# Altium schematic sheet Sheet2.SchDoc
size A4; SheetNumber: 1; SheetTotal: 2
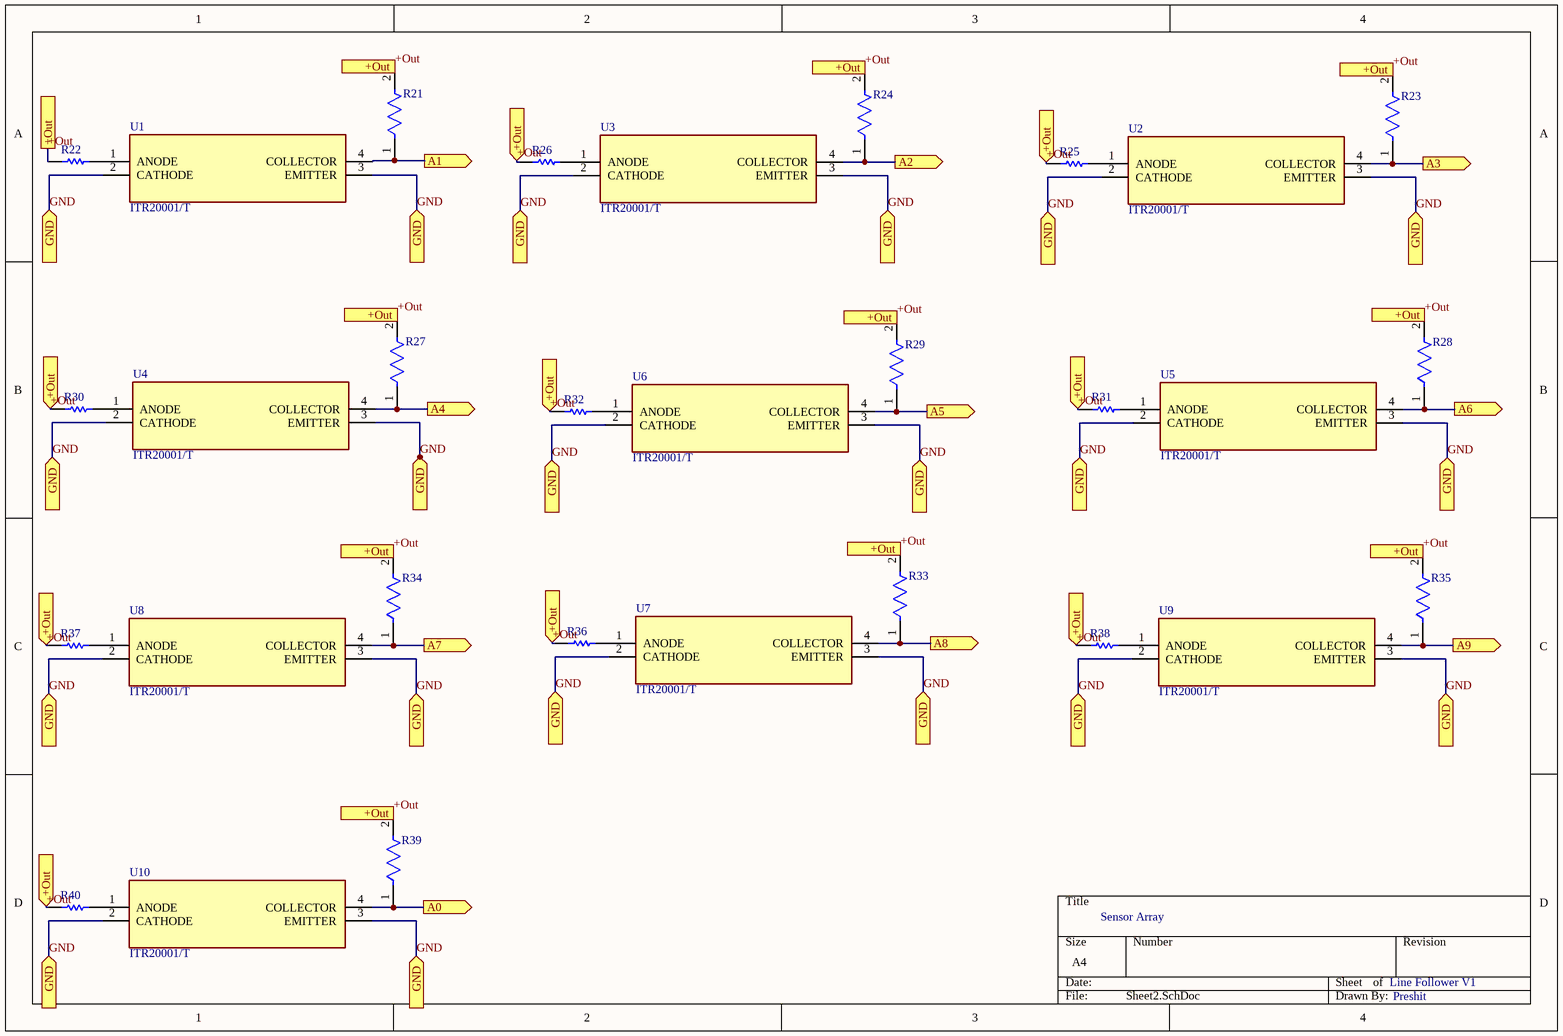
[diagram p0: Sheet2.SchDoc]

## Parts
R21  RN732BTTDK1002B10  [FP-RN732B-MFG]  (value not drawn)
R22  220R 1% 2512(6432)  [RESC2512(6432)_L]  (value not drawn)
R23  RN732BTTDK1002B10  [FP-RN732B-MFG]  (value not drawn)
R24  RN732BTTDK1002B10  [FP-RN732B-MFG]  (value not drawn)
R25  220R 1% 2512(6432)  [RESC2512(6432)_L]  (value not drawn)
R26  220R 1% 2512(6432)  [RESC2512(6432)_L]  (value not drawn)
R27  RN732BTTDK1002B10  [FP-RN732B-MFG]  (value not drawn)
R28  RN732BTTDK1002B10  [FP-RN732B-MFG]  (value not drawn)
R29  RN732BTTDK1002B10  [FP-RN732B-MFG]  (value not drawn)
R30  220R 1% 2512(6432)  [RESC2512(6432)_L]  (value not drawn)
R31  220R 1% 2512(6432)  [RESC2512(6432)_L]  (value not drawn)
R32  220R 1% 2512(6432)  [RESC2512(6432)_L]  (value not drawn)
R33  RN732BTTDK1002B10  [FP-RN732B-MFG]  (value not drawn)
R34  RN732BTTDK1002B10  [FP-RN732B-MFG]  (value not drawn)
R35  RN732BTTDK1002B10  [FP-RN732B-MFG]  (value not drawn)
R36  220R 1% 2512(6432)  [RESC2512(6432)_L]  (value not drawn)
R37  220R 1% 2512(6432)  [RESC2512(6432)_L]  (value not drawn)
R38  220R 1% 2512(6432)  [RESC2512(6432)_L]  (value not drawn)
R39  RN732BTTDK1002B10  [FP-RN732B-MFG]  (value not drawn)
R40  220R 1% 2512(6432)  [RESC2512(6432)_L]  (value not drawn)
U1  ITR20001/T  [RELAY4_ITR20001/T_EVE]
U2  ITR20001/T  [RELAY4_ITR20001/T_EVE]
U3  ITR20001/T  [RELAY4_ITR20001/T_EVE]
U4  ITR20001/T  [RELAY4_ITR20001/T_EVE]
U5  ITR20001/T  [RELAY4_ITR20001/T_EVE]
U6  ITR20001/T  [RELAY4_ITR20001/T_EVE]
U7  ITR20001/T  [RELAY4_ITR20001/T_EVE]
U8  ITR20001/T  [RELAY4_ITR20001/T_EVE]
U9  ITR20001/T  [RELAY4_ITR20001/T_EVE]
U10  ITR20001/T  [RELAY4_ITR20001/T_EVE]

## Ports
+Out (in, see Sheet1[2A], Sheet2[1A], Sheet2[1B], Sheet2[1C], Sheet2[1D], Sheet2[2A], Sheet2[2B], Sheet2[2C], Sheet2[3A], Sheet2[3B], Sheet2[3C], Sheet2[4A], Sheet2[4B]), +Out (in, see Sheet1[2A], Sheet2[1A], Sheet2[1B], Sheet2[1C], Sheet2[1D], Sheet2[2A], Sheet2[2B], Sheet2[2C], Sheet2[3A], Sheet2[3B], Sheet2[3C], Sheet2[4A], Sheet2[4B], Sheet2[4C]), +Out (in, see Sheet1[2A], Sheet2[1A], Sheet2[1B], Sheet2[1C], Sheet2[1D], Sheet2[2A], Sheet2[2B], Sheet2[2C], Sheet2[3A], Sheet2[3B], Sheet2[3C], Sheet2[4A], Sheet2[4C]), +Out (in, see Sheet1[2A], Sheet2[1A], Sheet2[1B], Sheet2[1C], Sheet2[1D], Sheet2[2A], Sheet2[2B], Sheet2[2C], Sheet2[3A], Sheet2[3B], Sheet2[3C], Sheet2[4B], Sheet2[4C]), +Out (in, see Sheet1[2A], Sheet2[1A], Sheet2[1B], Sheet2[1C], Sheet2[1D], Sheet2[2A], Sheet2[2B], Sheet2[3A], Sheet2[3B], Sheet2[3C], Sheet2[4A], Sheet2[4B], Sheet2[4C]), +Out (in, see Sheet1[2A], Sheet2[1A], Sheet2[1B], Sheet2[1C], Sheet2[1D], Sheet2[2A], Sheet2[2C], Sheet2[3A], Sheet2[3B], Sheet2[3C], Sheet2[4A], Sheet2[4B], Sheet2[4C]), +Out (in, see Sheet1[2A], Sheet2[1A], Sheet2[1B], Sheet2[1C], Sheet2[1D], Sheet2[2B], Sheet2[2C], Sheet2[3A], Sheet2[3B], Sheet2[3C], Sheet2[4A], Sheet2[4B], Sheet2[4C]), A0 (out, see Sheet1[4B]), A1 (out, see Sheet1[4B]), A2 (out, see Sheet1[4A]), A3 (out, see Sheet1[4A]), A4 (out, see Sheet1[4A]), A5 (out, see Sheet1[4A]), A6 (out, see Sheet1[4A]), A7 (out, see Sheet1[4A]), A8 (out, see Sheet1[4A]), A9 (out, see Sheet1[4A]), GND (in, see Sheet1[2B], Sheet2[1B], Sheet2[1C], Sheet2[1D], Sheet2[2B], Sheet2[2C], Sheet2[2D], Sheet2[3B], Sheet2[3C], Sheet2[4B]), GND (in, see Sheet1[2B], Sheet2[1B], Sheet2[1C], Sheet2[1D], Sheet2[2B], Sheet2[2C], Sheet2[2D], Sheet2[3B], Sheet2[3C], Sheet2[4B], Sheet2[4C]), GND (in, see Sheet1[2B], Sheet2[1B], Sheet2[1C], Sheet2[1D], Sheet2[2B], Sheet2[2C], Sheet2[3B], Sheet2[3C], Sheet2[4B], Sheet2[4C]), GND (in, see Sheet1[2B], Sheet2[1B], Sheet2[1C], Sheet2[2B], Sheet2[2C], Sheet2[2D], Sheet2[3B], Sheet2[3C], Sheet2[4B], Sheet2[4C]), GND (in, see Sheet1[2B], Sheet2[1B], Sheet2[1D], Sheet2[2B], Sheet2[2C], Sheet2[2D], Sheet2[3B], Sheet2[3C], Sheet2[4B], Sheet2[4C])

## Nets
+Out: R21.2 R22.1 R23.2 R24.2 R25.1 R26.1 R27.2 R28.2 R29.2 R30.1 R31.1 R32.1 R33.2 R34.2 R35.2 R36.1 R37.1 R38.1 R39.2 R40.1 ; port +Out
A0: R39.1 U10.4(COLLECTOR) ; port A0
A1: R21.1 U1.4(COLLECTOR) ; port A1
A2: R24.1 U3.4(COLLECTOR) ; port A2
A3: R23.1 U2.4(COLLECTOR) ; port A3
A4: R27.1 U4.4(COLLECTOR) ; port A4
A5: R29.1 U6.4(COLLECTOR) ; port A5
A6: R28.1 U5.4(COLLECTOR) ; port A6
A7: R34.1 U8.4(COLLECTOR) ; port A7
A8: R33.1 U7.4(COLLECTOR) ; port A8
A9: R35.1 U9.4(COLLECTOR) ; port A9
GND: U1.2(CATHODE) U1.3(EMITTER) U2.2(CATHODE) U2.3(EMITTER) U3.2(CATHODE) U3.3(EMITTER) U4.2(CATHODE) U4.3(EMITTER) U5.2(CATHODE) U5.3(EMITTER) U6.2(CATHODE) U6.3(EMITTER) U7.2(CATHODE) U7.3(EMITTER) U8.2(CATHODE) U8.3(EMITTER) U9.2(CATHODE) U9.3(EMITTER) U10.2(CATHODE) U10.3(EMITTER) ; port GND
NetR22_2: R22.2 U1.1(ANODE)
NetR25_2: R25.2 U2.1(ANODE)
NetR26_2: R26.2 U3.1(ANODE)
NetR30_2: R30.2 U4.1(ANODE)
NetR31_2: R31.2 U5.1(ANODE)
NetR32_2: R32.2 U6.1(ANODE)
NetR36_2: R36.2 U7.1(ANODE)
NetR37_2: R37.2 U8.1(ANODE)
NetR38_2: R38.2 U9.1(ANODE)
NetR40_2: R40.2 U10.1(ANODE)

## Notes on the sheet
- Sensor Array
- Line Follower V1
- Preshit

## Library data of the parts
R21 R23 R24 R27-R29 R33-R35 R39 = CMP-04015-036251-1: 10kΩ ±0.1% 0.125W, 1/8W Chip Resistor 1206 (3216 Metric) Moisture Resistant Thin Film; Voltage Rating: 150V; Power Rating: 125mW; Temperature Coefficient: 10ppm/°C; Resistance: 10kR; Value: 10kR; Case Code (Imperial): 1206; Weight: 0.000571oz; Composition: Thin Film; Max Operating Temperature: 125°C; Width: 1.6mm; Termination: SMD/SMT; Case/Package: 1206; Voltage Rating (DC): 150V; Tolerance: 0.1%; Min Operating Temperature: -55°C; Packaging: Tape and Reel; Case Code (Metric): 3216; Length: 3.2mm; Height: 0.6mm
R22 R25 R26 R30-R32 R36-R38 R40 = CMP-1018-00433-1: 220R 1W 1% 2512 (6432 Metric)  SMD; Case-EIA: 2512; Value: 220.00 Ohm; Case-Metric: 6432; Power: 1 W; Technology: SMT; Tolerance: 1 %
U1-U10 = CMP-005-000000-1: Reflective Optical Sensor 0.197 (5mm) 4-DIP (0.100, 2.54mm); MF: Everlight Electronics; MP: ITR20001/T; SnapEDA_Link: https://www.snapeda.com/parts/ITR20001/T/Everlight/view-part/?ref=snap; Check_prices: https://www.snapeda.com/parts/ITR20001/T/Everlight/view-part/?ref=eda; Value: *; Source: ITR20001_T.SchLib; Pin Count: 4; Component Type: Standard; Design Item ID: ITR20001/T; Package: DIP-4 Everlight